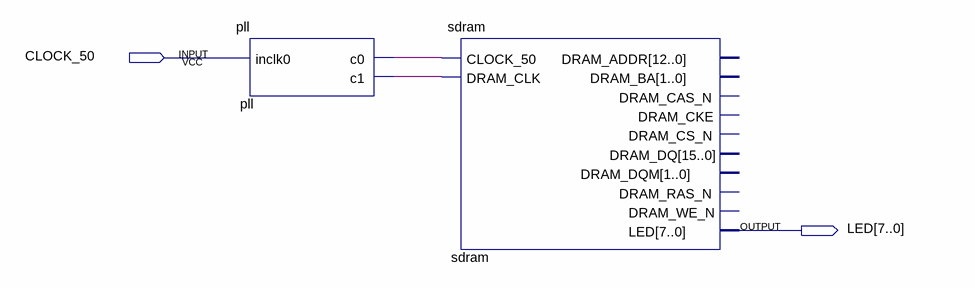
[diagram p0: schematic sheet]
// Quartus schematic top_level.bdf as structural Verilog: 2 symbols, 2 pins
module top_level (
  input  CLOCK_50,
  output [7:0] LED
);

  wire pll_c0, pll_c1;

  pll pll (.inclk0(CLOCK_50), .c0(pll_c0), .c1(pll_c1));
  sdram sdram (
    .CLOCK_50(pll_c0), .DRAM_CLK(pll_c1), .LED(LED));  // open: DRAM_ADDR, DRAM_BA, DRAM_CAS_N, DRAM_CKE, DRAM_CS_N, DRAM_DQM, DRAM_RAS_N, DRAM_WE_N, DRAM_DQ
endmodule
